# EAGLE design cc2652p_ch340e (EAGLE 9.6.2)
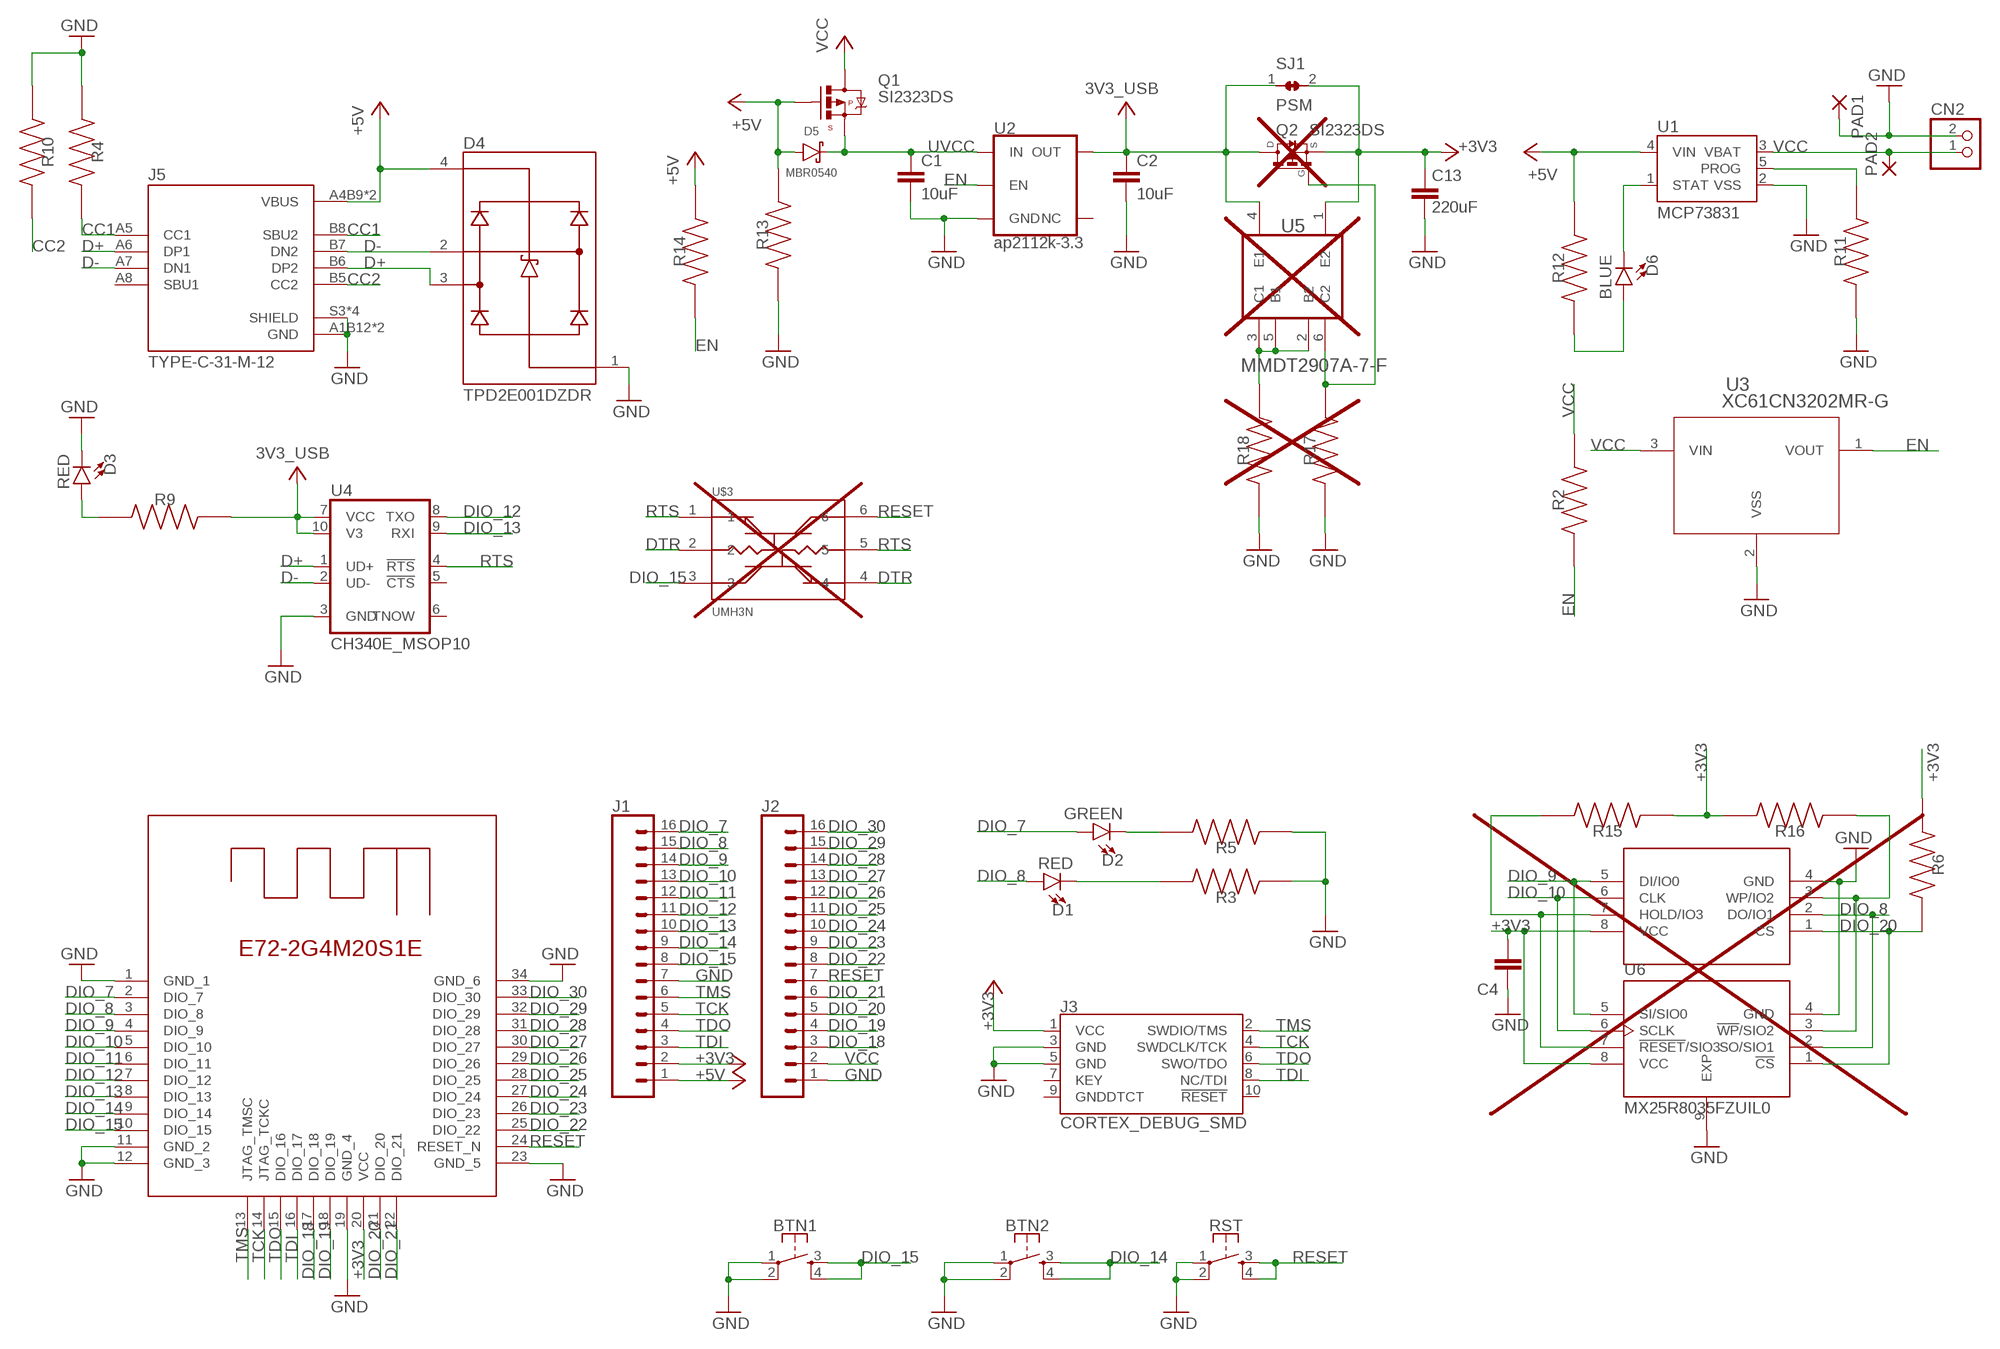
[diagram p0: schematic, sheet 1]

## Parts
BTN1  MOMENTARY-SWITCH-SPST-2-SMD-4.6X2.8MM  [TACTILE_SWITCH_SMD_4.6X2.8MM]
BTN2  MOMENTARY-SWITCH-SPST-2-SMD-4.6X2.8MM  [TACTILE_SWITCH_SMD_4.6X2.8MM]
C1  10uF  10UF-0603-6.3V-20%  [0603]
C2  10uF  10UF-0603-6.3V-20%  [0603]
C4  100n  CAP0402  [CAPC1005X40N]
C13  220uF  C_TANTALUM-2917(7343-METRIC)  [CAPM7343X310]
CN2  JST_2PIN-SMT-RA  [JST-PH-2-SMT-RA]
D1  RED  LED-RED0603  [LED-0603]
D2  GREEN  LED-GREEN0603  [LED-0603]
D3  RED  LED-RED0603  [LED-0603]
D4  TPD2E001DZDR  [SOT192P237X122-4N]
D5  MBR0540  DIODE-SCHOTTKY  [SOD-323]
D6  BLUE  LED-BLUE0603  [LED-0603]
J1  CONN_161X16_NO_SILK  [1X16_NO_SILK]
J2  CONN_161X16_NO_SILK  [1X16_NO_SILK]
J3  CORTEX_DEBUG_SMD  [SAMTECH_FTSH-105-01]
J5  TYPE-C-31-M-12  [HRO_TYPE-C-31-M-12]
PAD1  WIREPADSMD1,27-254  [SMD1,27-2,54]
PAD2  WIREPADSMD1,27-254  [SMD1,27-2,54]
Q1  SI2323DS  MOSFET-PCHANNEL  [SOT23]
Q2  SI2323DS  [SOT23]
R2  10k  RC0402FR-073M6L  [RESC1005X40N]
R3  2.2k  RC0402FR-073M6L  [RESC1005X40N]
R4  5.1k  RC0402FR-073M6L  [RESC1005X40N]
R5  2.2k  RC0402FR-073M6L  [RESC1005X40N]
R6  2.2k  RC0402FR-073M6L  [RESC1005X40N]
R9  2.2k  RC0402FR-073M6L  [RESC1005X40N]
R10  5.1k  RC0402FR-073M6L  [RESC1005X40N]
R11  2k  RC0402FR-073M6L  [RESC1005X40N]
R12  2.2k  RC0402FR-073M6L  [RESC1005X40N]
R13  10k  RC0402FR-073M6L  [RESC1005X40N]
R14  10k  RC0402FR-073M6L  [RESC1005X40N]
R15  0  RC0402FR-073M6L  [RESC1005X40N]
R16  0  RC0402FR-073M6L  [RESC1005X40N]
R17  100k  RC0402FR-073M6L  [RESC1005X40N]
R18  100k  RC0402FR-073M6L  [RESC1005X40N]
RST  MOMENTARY-SWITCH-SPST-2-SMD-4.6X2.8MM  [TACTILE_SWITCH_SMD_4.6X2.8MM]
SJ1  PSM  SMALL_SOLDER_JUMPER_CLOSED  [SMALL_SOLDER_JUMPER_CLOSED]
U1  MCP73831  [SOT23-5]
U2  ap2112k-3.3  V_REG_AP2112K-3.3V  [SOT23-5]
U3  XC61CN3202MR-G  [XC61C_SOT-23_TOR]
U4  CH340E_MSOP10  [MSOP10]
U5  MMDT2907A-7-F  [SOT65P210X110-6N]
U6  MX25R8035FZUIL0  [PSON50P200X300X60-9N]
U$1  E72-2G4M20S1E  [E72-2G4M20S1E]
U$2  MX25R8035FM1IL0  W25Q80BVSNIG  [SO-8]
U$3  UMH3N  [SOP65P210X100-6N]

## Nets
+3V3: C4.2 C13.1 J1.2 J3.1(VCC) Q2.2(S) R6.1 R15.1 R16.2 SJ1.2 U5.1(E2) U6.8(VCC) U$1.20(VCC) U$2.8(VCC)
+5V: D4.4(VCC) D5.A J1.1 J5.A4B9(VBUS) J5.B4A9(VBUS) Q1.1(G) R12.2 R13.2 R14.2 U1.4(VIN)
CC1: J5.A5(CC1) J5.B8(SBU2) R4.2
CC2: J5.B5(CC2) R10.2
D+: D4.3(IO2) J5.A6(DP1) J5.B6(DP2) U4.1(UD+)
D-: D4.2(IO1) J5.A7(DN1) J5.B7(DN2) U4.2(UD-)
DIO_7: D2.A J1.16 U$1.2(DIO_7)
DIO_8: D1.A J1.15 U6.2(SO/SIO1) U$1.3(DIO_8) U$2.2(DO/IO1)
DIO_9: J1.14 U6.5(SI/SIO0) U$1.4(DIO_9) U$2.5(DI/IO0)
DIO_10: J1.13 U6.6(SCLK) U$1.5(DIO_10) U$2.6(CLK)
DIO_11: J1.12 U$1.6(DIO_11)
DIO_12: J1.11 U4.8(TXO) U$1.7(DIO_12)
DIO_13: J1.10 U4.9(RXI) U$1.8(DIO_13)
DIO_14: BTN2.3 BTN2.4 J1.9 U$1.9(DIO_14)
DIO_15: BTN1.3 BTN1.4 J1.8 U$1.10(DIO_15) U$3.3
DIO_18: J2.3 U$1.17(DIO_18)
DIO_19: J2.4 U$1.18(DIO_19)
DIO_20: J2.5 R6.2 U6.1(!CS) U$1.21(DIO_20) U$2.1(CS)
DIO_21: J2.6 U$1.22(DIO_21)
DIO_22: J2.8 U$1.25(DIO_22)
DIO_23: J2.9 U$1.26(DIO_23)
DIO_24: J2.10 U$1.27(DIO_24)
DIO_25: J2.11 U$1.28(DIO_25)
DIO_26: J2.12 U$1.29(DIO_26)
DIO_27: J2.13 U$1.30(DIO_27)
DIO_28: J2.14 U$1.31(DIO_28)
DIO_29: J2.15 U$1.32(DIO_29)
DIO_30: J2.16 U$1.33(DIO_30)
DTR: U$3.2 U$3.4
EN: R2.1 R14.1 U2.3(EN) U3.1(VOUT)
GND: BTN1.1 BTN1.2 BTN2.1 BTN2.2 C1.2 C2.2 C4.1 C13.2 CN2.2 D3.C D4.1(GND) J1.7 J2.1 J3.3(GND) J3.5(GND) J5.A1B12(GND) J5.B1A12(GND) J5.S3(SHIELD) J5.S4(SHIELD) J5.S5(SHIELD) J5.S6(SHIELD) PAD1.1(P) R3.1 R4.1 R5.1 R10.1 R11.1 R13.1 R17.1 R18.1 RST.1 RST.2 U1.2(VSS) U2.2(GND) U3.2(VSS) U4.3(GND) U6.4(GND) U6.9(EXP) U$1.1(GND_1) U$1.11(GND_2) U$1.12(GND_3) U$1.19(GND_4) U$1.23(GND_5) U$1.34(GND_6) U$2.4(GND)
N$2: D1.C R3.2
N$3: D2.C R5.2
N$4: R18.2 U5.2(B2) U5.3(C1) U5.5(B1)
N$7: D3.A R9.2
N$8: R11.2 U1.5(PROG)
N$9: D6.A R12.1
N$10: Q2.1(G) R17.2 U5.6(C2)
N$11: D6.C U1.1(STAT)
N$12: R15.2 U6.7(!RESET!/SIO3) U$2.7(HOLD/IO3)
N$15: R16.1 U6.3(!WP!/SIO2) U$2.3(WP/IO2)
RESET: J2.7 RST.3 RST.4 U$1.24(RESET_N) U$3.6
RTS: U4.4(!RTS) U$3.1 U$3.5
TCK: J1.5 J3.4(SWDCLK/TCK) U$1.14(JTAG_TCKC)
TDI: J1.3 J3.8(NC/TDI) U$1.16(DIO_17)
TDO: J1.4 J3.6(SWO/TDO) U$1.15(DIO_16)
TMS: J1.6 J3.2(SWDIO/TMS) U$1.13(JTAG_TMSC)
UVCC: C1.1 D5.C Q1.2(S) U2.1(IN)
V+: C2.1 Q2.3(D) R9.1 SJ1.1 U2.5(OUT) U4.7(VCC) U4.10(V3) U5.4(E1) ; supply symbol labelled 3V3_USB
VCC: CN2.1 J2.2 PAD2.1(P) Q1.3(D) R2.2 U1.3(VBAT) U3.3(VIN)
Unconnected: J3.7(KEY) J3.9(GNDDTCT) J3.10(!RESET) J5.A8(SBU1) U2.4(NC) U4.5(!CTS) U4.6(TNOW)

## Library data of the parts
BTN1 BTN2 RST = SparkFun-Switches:MOMENTARY-SWITCH-SPST-2: Momentary Switch (Pushbutton) - SPST - Two Circuits Normally-open (NO) SPST momentary switches (buttons, pushbuttons). Schematic symbol includes two switch circuits. Variants SMD-4.6MMX2.8MM - 4.60mm x 2.80mm Tactile Momentary Button Switch - Used on SparkFun SAMD21 Mini Breakout <https://www.sparkfun.com/products/13664> SMD-5.2MM - Mini Pushbutton Switch - SMD <https://www.sparkfun.com/products/8720> - Used on Arduino Pro Mini <https://www.sparkfun.com/products/11114>; PROD_ID: SWCH-13065
C1 C2 = SparkFun-Capacitors:10UF: 10.0µF ceramic capacitors A capacitor is a passive two-terminal electrical component used to store electrical energy temporarily in an electric field.; PROD_ID: CAP-11015
C4 = discretes-dev:CAP0402: CAP, 0402; AVAILABILITY: Good; DESCRIPTION: RESISTOR, 0402 0.063W 1% 3M6; Resistance:3.6Mohm; Resistance Tolerance:± 1%; Power Rating:0.063W; Voltage Rating:50V; Series:RC32H; Temperature Coefficient:± 100ppm/°C; Resistor Element Type:Thick Film; Resistor Case Style:0402; No. of Pins:2; SVHC:No SVHC; Case Style:0402; External Length / Height:1mm; Temperature Coeff. +:100ppm/°C; Temperature Coeff. -:100ppm/°C; External Depth:0.35mm; External Width:0.5mm; Operating Temperature Range:-55°C to +155°C; Overload Voltage:100V; MF: Yageo; MP: RC0402FR-073M6L; PACKAGE: 1005 Panasonic Electronic Components; PRICE: None; PURCHASE-URL: https://pricing.snapeda.com/search/part/RC0402FR-073M6L/?ref=eda
C13 = Capacitor:C: Capacitor - Generic; CATEGORY: Capacitor
CN2 = adafruit:JST_2PIN: JST 2-Pin Connectors of various flavors SMT-RA (S2B-PH-SM4) 4UConnector #17311 SMT (B2B-PH-SM4) THM-RA (S2B-PH) THM (B2B-PH)
D1 D3 = SparkFun-LED:LED-RED: Red SMD LED Used in manufacturing of most products at SparkFun Packages: 0603 - SMD 0603 package [Product Link] <http://docs.avagotech.com/docs/AV02-0551EN> 0603 SMART - SMD 0603 SMART package ( more efficient and expensive)[Product Link] <http://www.osram-os.com/Graphics/XPic2/00077099_0.pdf> 1206 - SMD1206 package [Product Link] <https://www.sparkfun.com/datasheets/DevTools/LilyPad/Q150OVS4.pdff> SparkFun Products: Pro Mini 328 -5V <https://www.sparkfun.com/products/821> RedBoard <https://www.sparkfun.com/products/12757> IOIO-OTG <https://www.sparkfun.com/products/13613>; PROD_ID: DIO-00819
D2 = SparkFun-LED:LED-GREEN: Green SMD LED Used in manufacturing of various products at SparkFun Packages: 0603 - SMD 0603 package [Product Link] <http://www.futureelectronics.com/en/technologies/semiconductors/optoelectronics/leds/Pages/9894312-LTST-C190GKT.aspx?CrossPart=HSMG-C190&IM=0> LilyPad 1206 - SMD1206 LilyPad package [Product Link] <http://www.futureelectronics.com/en/Technologies/Product.aspx?ProductID=IN150NGHARVATEKCORPORATION2049943&IM=0> 1206 - SMD1206 package [Product Link] <http://www.futureelectronics.com/en/technologies/semiconductors/optoelectronics/leds/Pages/8315665-LTST-C150KGKT.aspx?IM=0> 1206 Bottom Mount -SMD 1206 Bottom Mount [Product Link] <http://www.digikey.com/product-detail/en/lite-on-inc/LTST-C230KGKT/160-1456-1-ND/386854> SparkFun Products: Pro Mini 328 -5V <https://www.sparkfun.com/products/821> RedBoard <https://www.sparkfun.com/products/12757> MP3 Trigger <https://www.sparkfun.com/products/13720> Makey Makey <https://www.sparkfun.com/products/11076>; PROD_ID: DIO-00821
D4 = TPD2E001DZDR:TPD2E001DZDR: Low-capacitance 2-channel +/-15k-V ESD protection array for high-speed data interfaces Check prices <https://pricing.snapeda.com/parts/TPD2E001DZDR/Texas%20Instruments/view-part?ref=eda>; AVAILABILITY: In Stock; DESCRIPTION: Low-capacitance 2-channel +/-15k-V ESD protection array for high-speed data interfaces 4-SOT-23 -40 to 85; MF: Texas Instruments; MP: TPD2E001DZDR; PACKAGE: SOT-23-4 Texas Instruments; PRICE: None; PURCHASE-URL: https://pricing.snapeda.com/search/part/TPD2E001DZDR/?ref=eda
D5 = pimoroni-passives:DIODE-SCHOTTKY
D6 = SparkFun-LED:LED-BLUE: Blue SMD LED Used in manufacturing of various products at SparkFun Packages: 0603 - SMD 0603 package [Product Link] <http://www.digikey.com/product-detail/en/SMLE12BC7TT86/511-1589-2-ND/1641808> 1206 - SMD1206 package [Product Link] <http://www.digikey.com/product-detail/en/lite-on-inc/LTST-C150TBKT/160-1643-1-ND/573584> SparkFun Products: ESP8266 Thing-Dev Board <https://www.sparkfun.com/products/13711> RedBoard <https://www.sparkfun.com/products/12757>; PROD_ID: DIO-08575
J1 J2 = SparkFun-Connectors:CONN_16: Multi connection point. Often used as Generic Header-pin footprint for 0.1 inch spaced/style header connections On any of the 0.1 inch spaced packages, you can populate with these: Break Away Headers - Straight <https://www.sparkfun.com/products/116> (PRT-00116) Break Away Male Headers - Right Angle <https://www.sparkfun.com/products/553> (PRT-00553) Female Headers <https://www.sparkfun.com/products/115> (PRT-00115) Break Away Headers - Machine Pin <https://www.sparkfun.com/products/117> (PRT-00117) Break Away Female Headers - Swiss Machine Pin <https://www.sparkfun.com/products/743> (PRT-00743) For SCREWTERMINALS and SPRING TERMINALS visit here: Screw Terimnals on SparkFun.com <https://www.sparkfun.com/search/results?term=Screw+Terminals> (5mm/3.5mm/2.54mm spacing) This device is also useful as a general connection point to wire up your design to another part of your project. Our various solder wires solder well into these plated through hole pads. Hook-Up Wire - Assortment (Stranded, 22 AWG) <https://www.sparkfun.com/products/11375> (PRT-11375) Hook-Up Wire - Assortment (Solid Core, 22 AWG) <https://www.sparkfun.com/products/11367> (PRT-11367) View the entire wire category on our website here <https://www.sparkfun.com/categories/141> Special notes: Molex polarized connector foot print use with SKU : PRT-08231 with associated crimp pins and housings. 1MM SMD Version SKU: PRT-10208 NOTES ON THE VARIANTS LOCK and LOCK_LONGPADS... This footprint was designed to help hold the alignment of a through-hole component (i.e. 6-pin header) while soldering it into place. You may notice that each hole has been shifted either up or down by 0.005 of an inch from it's more standard position (which is a perfectly straight line). This slight alteration caused the pins (the squares in the middle) to touch the edges of the holes. Because they are alternating, it causes a "brace" to hold the component in place. 0.005 has proven to be the perfect amount of "off-center" position when using our standard breakaway headers. Although looks a little odd when you look at the bare footprint, once you have a header in there, the alteration is very hard to notice. Also,if you push a header all the way into place, it is covered up entirely on the bottom side.
J3 = SparkFun-Connectors:CORTEX_DEBUG: Cortex Debug Connector - 10 pin Supports JTAG debug, Serial Wire debug, and Serial Wire Viewer. PTH and SMD connector options available. General Connector Information <http://infocenter.arm.com/help/topic/com.arm.doc.faqs/attached/13634/cortex_debug_connectors.pdf> Products: PTH Connector <http://www.digikey.com/product-detail/en/cnc-tech/3220-10-0100-00/1175-1627-ND/3883661> -via Digi-Key SparkFun PSoc <https://www.sparkfun.com/products/13229> SparkFun T <https://www.sparkfun.com/products/13810>
J5 = TYPE-C-31-M-12:TYPE-C-31-M-12: USB Connectors 24 Receptacle 1 8.94*7.3mm RoHS Check availability <https://pricing.snapeda.com/parts/TYPE-C-31-M-12/HRO%20Electronics%20Co.%2C%20Ltd./view-part?ref=eda>; AVAILABILITY: Not in stock; DESCRIPTION: USB Connectors 24 Receptacle 1 8.94*7.3mm RoHS; MF: HRO Electronics Co., Ltd.; MP: TYPE-C-31-M-12; PACKAGE: Package; PRICE: None
PAD1 PAD2 = wirepad:WIREPAD: Wire PAD connect wire on PCB
Q1 = pimoroni-passives:MOSFET-PCHANNEL: Generic PMOSFET
Q2 = SI2323DS:SI2323DS: P-Channel MOSFET; AVAILABILITY: Unavailable; DESCRIPTION: P-Channel 20V 3.7A (Ta) 750mW (Ta) Surface Mount SOT-23-3 (TO-236); MF: Vishay Siliconix; MP: SI2323DS; PACKAGE: SOT-23-3 Vishay Siliconix; PRICE: None
R2-R6 R9-R18 = RC0402FR-073M6L:RC0402FR-073M6L: RESISTOR, 0402 0.063W 1% 3M6; Resistance:3.6Mohm; Resistance Tolerance:± 1%; Power Rating:0.063W; Voltage Rating:50V; Series:RC32H; Temperature Coefficient:± 100ppm/°C; Resistor Element Type:Thick Film; Resistor Case Style:0402; No. of Pins:2; SVHC:No SVHC; Case Style:0402; External Length / Height:1mm; Temperature Coeff. +:100ppm/°C; Temperature Coeff. -:100ppm/°C; External Depth:0.35mm; External Width:0.5mm; Operating Temperature Range:-55°C to +155°C; Overload Voltage:100V Check prices <https://pricing.snapeda.com/parts/RC0402FR-073M6L/Yageo/view-part?ref=eda>; AVAILABILITY: Good; DESCRIPTION: RESISTOR, 0402 0.063W 1% 3M6; Resistance:3.6Mohm; Resistance Tolerance:± 1%; Power Rating:0.063W; Voltage Rating:50V; Series:RC32H; Temperature Coefficient:± 100ppm/°C; Resistor Element Type:Thick Film; Resistor Case Style:0402; No. of Pins:2; SVHC:No SVHC; Case Style:0402; External Length / Height:1mm; Temperature Coeff. +:100ppm/°C; Temperature Coeff. -:100ppm/°C; External Depth:0.35mm; External Width:0.5mm; Operating Temperature Range:-55°C to +155°C; Overload Voltage:100V; MF: Yageo; MP: RC0402FR-073M6L; PACKAGE: 1005 Panasonic Electronic Components; PRICE: None; PURCHASE-URL: https://pricing.snapeda.com/search/part/RC0402FR-073M6L/?ref=eda
SJ1 = pimoroni-misc:SMALL_SOLDER_JUMPER_CLOSED
U1 = SparkFun-IC-Power:MCP73831: MCP73831T Li-Ion, Li-Pol Controller Miniature single cell, fully integrated Li-Ion, Li-polymer charge management controller Datasheet <http://ww1.microchip.com/downloads/en/DeviceDoc/20001984g.pdf> SparkFun Products: SparkFun ESP32 Thing <https://www.sparkfun.com/products/13907> SparkFun 9DoF Razor IMU M0 <https://www.sparkfun.com/products/14001>; PROD_ID: IC-09995
U2 = SparkFun-IC-Power:V_REG_AP2112: AP2112 - 600mA CMOS LDO Regulator w/ Enable The AP2112 is CMOS process low dropout linear regulator with enable function, the regulator delivers a guaranteed 600mA (min.) continuous load current. Features Output Voltage Accuracy: ±1.5% Output Current: 600mA (Min.) Foldback Short Current Protection: 50mA Enable Function to Turn ON/OFF VOUT Low Dropout Voltage (3.3V): 250mV (Typ.) @IOUT=600mA Excellent Load Regulation: 0.2%/A (Typ.) Excellent Line Regulation: 0.02%/V (Typ.) Low Quiescent Current: 55μA (Typ.) Low Standby Current: 0.01μA (Typ.) Low Output Noise: 50μVRMS PSRR: 100Hz -65dB, 1kHz -65dB OTSD Protection Stable with 1.0μF Flexible Cap: Ceramic, Tantalum and Aluminum Electrolytic Operation Temperature Range: -40°C to 85°C ESD: MM 400V, HBM 4000V; PROD_ID: VREG-12457; VALUE: 3.3V
U3 = XC61CN3202MRG:XC61CN3202MR-G; BUILT_BY: EMA_UL_Team; MANUFACTURER_PART_NUMBER: XC61CN3202MR-G; SOURCELIBRARY: Torex_2016-06-30_2; VENDOR: Torex Semiconductor
U4 = CH340E:CH340E: Check prices <https://pricing.snapeda.com/parts/CH340E/WCH/view-part?ref=eda>; AVAILABILITY: Not in stock; DESCRIPTION: USB to serial chip CH340; MF: WCH; MP: CH340E; PACKAGE: Package; PRICE: None
U5 = MMDT2907A-7-F:MMDT2907A-7-F: DUAL PNP SMALL SIGNAL SURFACE MOUNT TRANSISTOR Check availability <https://pricing.snapeda.com/parts/MMDT2907A-7-F/Diodes%20Inc./view-part?ref=eda>; AVAILABILITY: In Stock; DESCRIPTION: Bipolar (BJT) Transistor Array 2 PNP (Dual) 60V 600mA 200MHz 200mW Surface Mount SOT-363; MF: Diodes Inc.; MP: MMDT2907A-7-F; PACKAGE: SOT-363 Diodes Inc.; PRICE: None; PURCHASE-URL: https://pricing.snapeda.com/search/part/MMDT2907A-7-F/?ref=eda
U6 = MX25R8035FZUIL0:MX25R8035FZUIL0: FLASH - NOR Memory IC 8Mb (1M x 8) SPI - Quad I/O 33 MHz 8-USON (2x3) Check availability <https://pricing.snapeda.com/parts/MX25R8035FZUIL0/Macronix/view-part?ref=eda>; AVAILABILITY: In Stock; DESCRIPTION: NOR Flash Serial 1.8V/3.3V 8M-bit 8M/4M/2M x 1/2-bit/4-bit 12ns 8-Pin USON EP; MF: Macronix; MP: MX25R8035FZUIL0; PACKAGE: None; PRICE: None; PURCHASE-URL: https://pricing.snapeda.com/search/part/MX25R8035FZUIL0/?ref=eda
U$1 = E72-2G4M20S1E:E72-2G4M20S1E
U$2 = W25Q80BVSNIG:W25Q80BVSNIG: Check availability <https://pricing.snapeda.com/parts/W25Q80BVSNIG/Winbond%20Electronics/view-part?ref=eda>; AVAILABILITY: In Stock; DESCRIPTION: FLASH - NOR Memory IC 8Mb (1M x 8) SPI - Quad I/O 104 MHz 8-SOIC; MF: Winbond Electronics; MP: W25Q80BVSNIG; PACKAGE: SOIC-8 Winbond; PRICE: None
U$3 = UMH3N:UMH3N: Dual PNP/NPN transistor for chip reset; AVAILABILITY: Unavailable; DESCRIPTION: Pre-Biased Bipolar Transistor (BJT) 2 NPN - Pre-Biased (Dual) 50V 100mA 250MHz 150mW Surface Mount UMT6; MF: Rohm; MP: UMH3N; PACKAGE: SOT-363 Rohm; PRICE: None

## Board
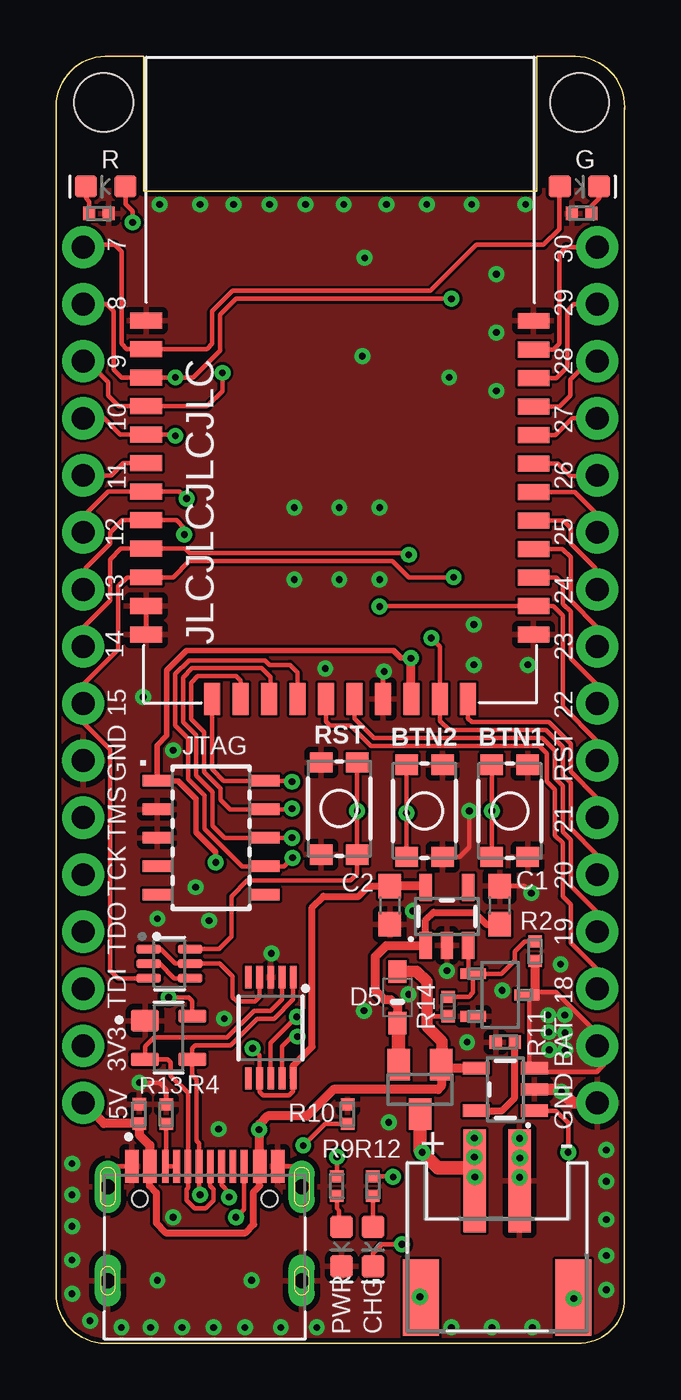
[diagram p1: board, top side]
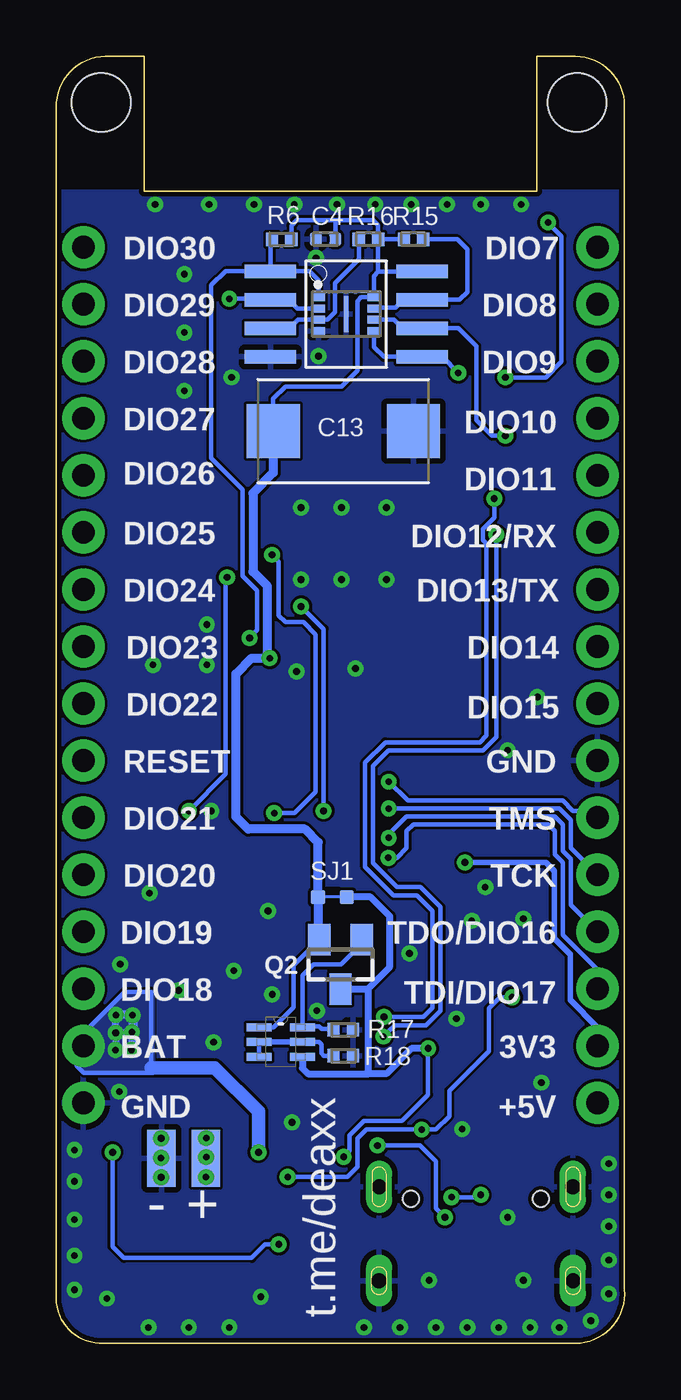
[diagram p2: board, bottom side, seen from below]

Size 25.32 x 57.31 mm. Coordinates in mm from the lower left corner, seen from the top.
Outline: 2.31,0.01 2.41,0.01
Outline: 2.41,0.01 23.21,0.01 arc87 25.31,1.81 25.31,54.81
Outline: 2.31,57.31 2.41,57.31
Outline: 2.41,57.31 arc87 0.01,55.31 0.01,2.41 arc100 2.41,0.01
Outline: 2.41,57.31 3.91,57.31 3.91,51.31 21.41,51.31 21.41,57.31 22.91,57.31
Outline: 22.91,57.31 23.01,57.31
Outline: 25.31,55.01 25.31,54.81
Outline: 22.91,57.31 arc-100 25.31,54.81
Copper layers (1*16): Top 0.035mm / dielectric 1.5mm / Bottom 0.035mm
Design rules "default *": minimum track width 0.2mm, minimum drill 0.3mm, track to track 5mil, track to pad 5mil, pad to pad 5mil, via to via 5mil, smd to smd 5mil, copper to edge 0.2mm, drill to drill 0.3mm, minimum pad ring 10mil, minimum via ring 8mil, stop-mask expansion 2mil, vias tented up to drill 0.3mm, thermal gap 10mil
Holes 2.6 mm at 2.12,55.26 23.32,55.26
bRestrict: 4 lines

### Footprints (pad centres in the part's own frame; a part is rotated, then mirrored left to right if it is on the bottom)
TACTILE_SWITCH_SMD_4.6X2.8MM = smd 0.9 x 1: 1 -2.05,-0.8; 2 2.05,-0.8; 3 2.05,0.8; 4 -2.05,0.8
0603 = smd 1.1 x 1: 1 -0.85,0; 2 0.85,0
CAPC1005X40N = smd 0.54 x 0.6: 1 -0.432,0; 2 0.432,0
CAPM7343X310 = smd 2.368 x 2.404: 1 -3.121,0; 2 3.121,0
JST-PH-2-SMT-RA = smd 1 x 4.6: 1 1,-3.7; 2 -1,-3.7 | smd 1.6 x 3.4: NC1 -3.4,1.5; NC2 3.4,1.5
LED-0603 = smd 1 x 1: A -0.877,0; C 0.877,0
SOT192P237X122-4N = smd 1.24 x 0.99: 1 -1.055,0.76 | smd 1.24 x 0.59: 2 -1.055,-0.96; 3 1.055,-0.96; 4 1.055,0.96
SOD-323 = smd 1 x 0.8: A 1.15,0; C -1.15,0
1X16_NO_SILK = drill 1.016 pad 1.88: 1 0,0; 2 2.54,0; 3 5.08,0; 4 7.62,0; 5 10.16,0; 6 12.7,0; 7 15.24,0; 8 17.78,0; 9 20.32,0; 10 22.86,0; 11 25.4,0; 12 27.94,0; 13 30.48,0; 14 33.02,0; 15 35.56,0; 16 38.1,0
SAMTECH_FTSH-105-01 = smd 0.508 x 1.27: 1 -2.54,-2.413; 2 -2.54,2.413; 3 -1.27,-2.413; 4 -1.27,2.413; 5 0,-2.413; 6 0,2.413; 7 1.27,-2.413; 8 1.27,2.413; 9 2.54,-2.413; 10 2.54,2.413
HRO_TYPE-C-31-M-12 = smd 0.6 x 1.45: A1B12 -3.25,5.095; A4B9 -2.45,5.095; B1A12 3.25,5.095; B4A9 2.45,5.095 | smd 0.3 x 1.45: A5 -1.25,5.095; A6 -0.25,5.095; A7 0.25,5.095; A8 1.25,5.095; B5 1.75,5.095; B6 0.75,5.095; B7 -0.75,5.095; B8 -1.75,5.095 | drill 0.65 pad 1.05 long: S1 -4.313,4.182; S2 4.318,4.187; S3 -4.32,0; S4 4.32,0; S5 -4.315,4.191; S6 4.318,4.18 | hole 0.7: -2.89,3.65; 2.89,3.65
SMD1,27-2,54 = smd 1.27 x 2.54: 1 0,0
SOT23 = smd 1 x 1.4: 1 -0.95,-1.1; 2 0.95,-1.1; 3 0,1.1
RESC1005X40N = smd 0.54 x 0.6: 1 -0.432,0; 2 0.432,0
SMALL_SOLDER_JUMPER_CLOSED = smd 0.635 x 0.635: 1 -0.635,0; 2 0.635,0
SOT23-5 = smd 0.55 x 1.2: 1 -0.95,-1.3; 2 0,-1.3; 3 0.95,-1.3; 4 0.95,1.3; 5 -0.95,1.3
XC61C_SOT-23_TOR = smd 0.483 x 1.118: 1 -0.95,-1.194; 2 0.95,-1.194; 3 0,1.194
MSOP10 = smd 1 x 0.3: 1 -2.25,1; 2 -2.25,0.5; 3 -2.25,0; 4 -2.25,-0.5; 5 -2.25,-1; 6 2.25,-1; 7 2.25,-0.5; 8 2.25,0; 9 2.25,0.5; 10 2.25,1
SOT65P210X110-6N = smd 1.118 x 0.356: 1 -0.965,0.66; 2 -0.965,0; 3 -0.965,-0.66; 4 0.965,-0.66; 5 0.965,0; 6 0.965,0.66
PSON50P200X300X60-9N = smd 0.56 x 0.35: 1 -1.235,0.75; 2 -1.235,0.25; 3 -1.235,-0.25; 4 -1.235,-0.75; 5 1.235,-0.75; 6 1.235,-0.25; 7 1.235,0.25; 8 1.235,0.75 | smd 0.2 x 1.6: 9 0,0
E72-2G4M20S1E = smd 0.711 x 1.422: 1 17.098,17.411; 2 15.828,17.411; 3 14.558,17.411; 4 13.288,17.411; 5 12.018,17.411; 6 10.748,17.411; 7 9.478,17.411; 8 8.208,17.411; 9 6.938,17.411; 10 5.668,17.411; 11 4.398,17.411; 12 3.128,17.411; 23 3.115,0.143; 24 4.385,0.143; 25 5.655,0.143; 26 6.925,0.143; 27 8.195,0.143; 28 9.465,0.143; 29 10.735,0.143; 30 12.005,0.143; 31 13.275,0.143; 32 14.545,0.143; 33 15.815,0.143; 34 17.085,0.143 | smd 1.422 x 0.711: 13 0.246,14.471; 14 0.246,13.201; 15 0.246,11.931; 16 0.246,10.661; 17 0.246,9.391; 18 0.246,8.121; 19 0.246,6.851; 20 0.246,5.581; 21 0.246,4.311; 22 0.244,3.064
SO-8 = smd 2.286 x 0.61: 1 -3.378,1.27; 2 -3.378,0; 3 -3.378,-1.27; 4 -3.378,-2.54; 5 3.378,-2.54; 6 3.378,-1.27; 7 3.378,0; 8 3.378,1.27
SOP65P210X100-6N = smd 1.09 x 0.4: 1 -0.92,0.65; 2 -0.92,0; 3 -0.92,-0.65; 4 0.92,-0.65; 5 0.92,0; 6 0.92,0.65

### Placement (x,y rotation side)
BTN1  20.21,23.71 90 top
BTN2  16.41,23.71 90 top
C1  19.76,19.51 90 top
C2  14.86,19.51 270 top
C4  13.32,49.16 0 bottom
C13  12.53,40.62 0 bottom
CN2  19.64,3.54 180 top
D1  2.21,51.51 180 top
D2  23.31,51.51 0 top
D3  12.71,4.31 270 top
D4  5.01,13.61 0 top
D5  15.21,15.41 90 top
D6  14.11,4.31 270 top
J1  1.21,10.71 90 top
J2  24.11,10.71 90 top
J3  6.91,22.51 270 top
J5  6.62,2.79 0 top
PAD1  20.63,8.25 0 bottom
PAD2  18.66,8.25 0 bottom
Q1  16.21,11.31 180 top
Q2  12.66,16.87 180 bottom
R2  21.33,17.46 270 top
R3  1.91,50.31 180 top
R4  4.91,10.21 270 top
R5  23.41,50.31 0 top
R6  15.28,49.16 180 bottom
R9  12.51,7.01 270 top
R10  12.98,10.21 270 top
R11  20.01,13.41 0 top
R12  14.11,7.01 90 top
R13  3.7,10.22 270 top
R14  17.46,15 270 top
R15  9.4,49.16 0 bottom
R16  11.41,49.16 0 bottom
R17  12.53,13.97 180 bottom
R18  12.53,12.81 180 bottom
RST  12.61,23.81 270 top
SJ1  13.02,19.87 180 bottom
U1  20.01,11.31 90 top
U2  17.41,19.01 0 top
U3  19.77,15.51 270 top
U4  9.56,14.05 270 top
U5  15.31,13.42 0 bottom
U6  12.4,45.83 0 bottom
U$1  21.41,28.44 90 top
U$2  12.4,46.46 0 bottom
U$3  5.05,16.91 0 top

### Tracks (layer width: path | path; a pad name or v marks a point on that pad's centre or on a via)
+3V3  (via drill 0.3)
  Top 0.2: 4.54,25.01 J3.1 | 15.76,30.56 v15.81,30.51
  Top 0.254: v7.11,21.41 7.11,21.87 6.24,22.74 6.24,24.25 5.44,25.05 J3.1 4.5,26.63 4.93,27.06 4.93,29.96 5.81,30.84 15.02,30.84 15.35,30.51 v15.81,30.51
  Top 0.406: U$1.20 15.81,28.71 v15.81,30.51
  Bottom 0.2: U5.1 15.64,14.08 14.75,14.97 14.75,16.83 Q2.2 | U6.8 11.11,46.64 | U6.8 11.74,46.58 11.91,46.41 11.91,43.31 12.61,42.61 15.11,42.61 15.65,42.07 C13.1 | R15.1 R16.2 | R16.2 10.98,49.78 11.21,50.01 12.91,50.01 | 12.91,50.01 14.61,50.01 14.85,49.77 R6.1 | C4.2 12.89,49.99 12.91,50.01 | 11.21,46.62 U6.8 | U$2.8 9.05,47.71 10.96,47.71 | 10.96,47.71 10.98,47.71 11.17,47.52 U6.8 | R16.2 10.98,47.72 10.96,47.71
  Bottom 0.254: v7.11,21.41 3.5,21.41 3.13,21.04 3.13,18.03 2.43,17.33 2.43,15.28 1.21,14.07 J1.2 | 13.74,18.11 Q2.2
  Bottom 0.406: 13.74,18.11 13.65,18.2 SJ1.2 13.65,22.31 14.24,22.89 16.77,22.89 17.31,23.44 17.31,29.81 16.61,30.51 v15.81,30.51 15.91,30.61 15.91,33.71 16.56,34.36 16.56,37.86 15.65,38.77 C13.1
+5V  (via drill 0.3)
  Top 0.2: D4.4 6.06,15.25 5.91,15.41 v5.01,15.41 4.91,15.41 | R12.2 14.98,7.44 v15.01,7.41 | R13.2 3.71,9.78 | R14.2 16.56,14.57 16.51,14.62
  Top 0.254: v9.04,9.52 9.06,9.54
  Top 0.305: 15.36,16.71 D5.A | 9.06,9.76 9.04,9.74 | J5.B4A9 9.07,7.02 8.8,6.75 8.8,5.3 8.41,4.91 4.91,4.91 4.46,5.36 4.46,6.71 4.16,7.01 J5.A4B9
  Top 0.406: U1.4 17.31,12.26 Q1.1 17.16,11.46 17.01,11.31 12.35,11.31 11.17,10.13 9.43,10.13 9.06,9.76 | 15.26,16.61 D5.A | 9.04,9.74 v9.04,9.52 9.06,9.52 9.07,9.51 J5.B4A9 | 3.71,9.78 3.71,9.29 4.17,8.83 J5.A4B9 | R13.2 2.13,9.79 J1.1
  Top 0.508: D5.A 16.06,16.56 16.51,16.11 16.51,14.62 16.51,14.11 17.18,13.44 17.18,12.43 Q1.1
  Bottom 0.2: v5.01,15.41 5.55,15.41 6.05,14.91 6.05,13.01 7.81,11.25 7.81,10.11 8.4,9.52 v9.04,9.52 11.5,9.52 11.89,9.13 11.89,7.86 12.34,7.41 v15.01,7.41
CC1
  Top 0.2: R4.2 4.91,9.11 4.91,7.91 J5.B8 | J5.B8 | J5.B8 J5.A5
CC2  (via drill 0.3)
  Top 0.2: R10.2 11.98,9.78 v11.01,8.81 | J5.B5 8.37,5.97 v8.01,5.61
  Bottom 0.2: v8.01,5.61 8.41,6.01 8.41,8.11 9.11,8.81 v11.01,8.81
D+  (via drill 0.3)
  Top 0.2: 6.36,6.66 v6.41,6.61 6.37,6.65 J5.A6 6.37,8.9 6.26,9.01 6.26,11.76 6.06,11.95 D4.3 6.06,13.14 6.19,13.27 7.77,13.27 8.96,14.46 9.71,14.46 10.56,15.31 U4.1 | v7.71,6.51 7.71,6.71 7.36,7.06 J5.B6
  Bottom 0.2: v7.71,6.51 6.51,6.51 v6.41,6.61
D-
  Top 0.2: U4.2 10.06,15.31 9.56,14.81 8.81,14.81 7.62,13.62 4.36,13.62 3.95,13.21 D4.2 4.97,12.65 5.11,12.51 5.11,11.91 5.87,11.15 J5.B7 5.87,6.93 5.8,6.86 5.8,6.36 6.16,6 6.66,6 7.02,6.36 7.02,6.86 6.86,7.02 J5.A7
DIO_7
  Top 0.2: J1.16 1.31,48.91 2.61,48.91 2.91,48.61 2.91,44.51 3.15,44.27 U$1.2 6.72,44.27 6.96,44.51 6.96,45.96 7.86,46.86 16.66,46.86 18.71,48.91 21.71,48.91 22.41,49.61 22.41,51.49 D2.A
DIO_8  (via drill 0.3)
  Top 0.2: J1.15 2.25,46.27 2.56,45.96 2.56,43.36 2.92,43 U$1.3 v5.3,43 v5.31,43.01 6.11,43.01 7.31,44.21 7.31,45.81 8.01,46.51 v17.61,46.51 17.71,46.51 | v3.41,49.91 3.41,50.41 3.09,50.73 D1.A
  Bottom 0.2: v5.31,43.01 3.51,43.01 2.81,43.71 2.81,49.31 v3.41,49.91 | U6.2 14.58,46.08 14.96,46.46 U$2.2 15.82,46.51 v17.61,46.51
DIO_9  (via drill 0.3)
  Top 0.2: J1.14 1.39,43.73 2.31,42.81 2.31,42.21 2.79,41.73 U$1.4 6.73,41.73 7.41,42.41 v7.41,43.21
  Bottom 0.2: U6.5 11.17,44.37 10.72,43.92 U$2.5 8.12,43.92 v7.41,43.21
DIO_10  (via drill 0.3)
  Top 0.2: J1.13 2.13,41.19 2.86,40.46 U$1.5 5.26,40.46 v5.31,40.41
  Bottom 0.2: U6.6 10.28,45.58 9.89,45.19 U$2.6 9.01,45.21 7.41,45.21 6.61,44.41 6.61,41.11 5.91,40.41 v5.31,40.41
DIO_11
  Top 0.2: U$1.6 2.99,39.19 2.45,38.65 J1.12
DIO_12  (via drill 0.3)
  Top 0.2: J1.11 1.21,36.81 2.32,37.92 U$1.7 5.5,37.92 v5.81,37.61 | v10.72,14.54 9.56,13.38 U4.8
  Bottom 0.2: v5.81,37.61 5.81,36.77 6.32,36.26 6.32,35.76 6.16,35.6 6.16,27.06 6.46,26.76 10.66,26.76 11.56,25.86 11.56,21.2 10.31,19.95 9.26,19.95 8.57,19.26 8.57,14.94 8.97,14.54 v10.72,14.54
DIO_13  (via drill 0.3)
  Top 0.2: J1.10 1.31,33.67 1.31,34.52 2.4,35.62 2.4,36.11 2.94,36.65 U$1.8 5.37,36.65 5.71,36.31 v5.71,36.01 | U4.9 10.06,13.22 10.5,13.66 v10.75,13.66
  Bottom 0.2: v5.71,36.01 5.71,27.01 6.31,26.41 10.51,26.41 11.21,25.71 11.21,21.39 10.14,20.32 9.09,20.32 8.2,19.43 8.2,14.81 8.84,14.17 10.24,14.17 10.47,13.93 10.48,13.93 v10.75,13.66
DIO_14  (via drill 0.3)
  Top 0.2: U$1.9 2.88,35.38 2.4,34.9 2.4,33.08 1.21,31.88 J1.9 | BTN2.4 v15.61,23.61 BTN2.3 | U$1.9 4.2,35.18 | U$1.9 5.74,35.38 5.94,35.18 15.64,35.18 v15.71,35.11
  Bottom 0.2: v15.61,23.61 14.71,23.61 13.76,24.56 13.76,31.56 14.31,32.11 15.11,32.11 15.41,32.41 15.41,34.81 v15.71,35.11
DIO_15  (via drill 0.3)
  Top 0.2: BTN1.3 v19.41,23.71 BTN1.4 | U$3.3 2.76,16.26 2.4,16.62 2.4,26.44 1.21,27.64 J1.8 1.21,29.34 2.75,30.89 2.75,33.71 3.15,34.11 U$1.10 5.21,34.11 5.93,34.83 14.99,34.83 15.71,34.11 v17.71,34.11
  Bottom 0.2: v19.41,23.71 17.77,25.35 17.77,34.05 v17.71,34.11
DIO_18
  Top 0.2: J2.3 24.11,16.64 22.92,17.84 22.92,19.54 22.56,19.89 22.56,22.27 22.21,22.62 22.21,24.67 21.86,25.02 21.86,26.26 21.51,26.6 14.02,26.6 13.11,27.51 12.21,27.51 12.02,27.7 U$1.17
DIO_19
  Top 0.2: J2.4 24.11,19.18 22.92,20.38 22.92,22.42 22.56,22.77 22.56,24.81 22.21,25.16 22.21,26.41 21.66,26.96 14.16,26.96 13.29,27.83 U$1.18
DIO_20  (via drill 0.3)
  Top 0.2: J2.5 24.11,21.72 22.92,22.92 22.92,24.96 22.56,25.31 22.56,26.55 21.81,27.31 17.51,27.31 17.1,27.72 U$1.21 17.1,31.02 v16.71,31.41
  Bottom 0.2: U6.1 13.64,47.34 14.03,47.73 U$2.1 | v16.71,31.41 16.37,31.75 16.37,33.52 17.02,34.17 17.02,38.02 18.41,39.41 18.41,47.11 17.78,47.73 U$2.1 | R6.2 15.78,49.09 U$2.1
DIO_21
  Top 0.2: J2.6 24.11,24.26 22.92,25.46 22.92,26.7 21.95,27.66 18.51,27.66 18.35,27.82 U$1.22
DIO_22
  Top 0.2: U$1.25 22.28,34.1 22.56,33.81 22.56,32.93 22.92,32.58 22.92,30.5 24.11,29.31 J2.8
DIO_23
  Top 0.2: U$1.26 22.55,35.37 22.92,35 22.92,33.08 24.11,31.88 J2.9
DIO_24
  Top 0.2: U$1.27 22.59,36.64 22.92,36.31 22.92,35.62 24.01,34.52 24.01,33.67 J2.10
DIO_25
  Top 0.2: U$1.28 23.11,37.91 24.11,36.91 J2.11
DIO_26
  Top 0.2: U$1.29 22.34,39.18 22.91,38.61 24.07,38.61 J2.12
DIO_27
  Top 0.2: U$1.30 22.25,40.45 22.99,41.19 J2.13
DIO_28
  Top 0.2: U$1.31 22.42,41.72 22.91,42.21 22.91,42.91 23.73,43.73 J2.14
DIO_29
  Top 0.2: U$1.32 22.29,42.99 22.76,43.46 22.76,45.96 23.07,46.27 J2.15
DIO_30
  Top 0.2: U$1.33 22.16,44.26 22.41,44.51 22.41,48.51 22.71,48.81 J2.16
DTR
  Top 0.2: U$3.4 5.26,16.26 4.61,16.91 U$3.2
EN
  Top 0.2: U2.3 18.36,16.46 U3.1 | U3.1 19.84,16.46 20.43,17.05 20.43,17.45 20.87,17.89 R2.1 | R14.1 18.38,15.43 18.58,15.63 U3.1
GND  (via drill 0.3)
  Top 0.2: U$1.12 U$1.11 | R4.1 4.91,11.31 4.61,11.61 v3.71,11.61 | U$1.19 14.56,29.86 v14.61,29.91 | BTN2.1 17.96,21.66 18.41,22.11 v18.41,23.71 | C1.2 20.85,20.36 v21.16,20.05 | J5.S5 2.31,7.75 2.44,7.88 J5.A1B12 | J5.S6 10.94,7.71 10.77,7.88 J5.B1A12
  Top 0.508: U1.2 22.41,11.31 v22.51,11.21 23.01,10.71 J2.1
  other vias: 5.21,5.61 4.51,18.91 6.21,20.31 6.41,50.71 7.91,50.71 9.51,50.71 11.11,50.71 12.81,50.71 14.71,50.71 16.51,50.71 18.51,50.71 18.61,32.01 18.61,30.21 4.51,2.81 8.71,2.81 0.71,5.21 0.71,3.71 0.71,2.21 24.51,8.61 24.51,5.51 24.51,3.91 24.51,2.38 24.51,7.21 4.61,50.71 18.31,13.41 5.21,26.41 1.51,1.01 2.91,0.71 4.21,0.71 5.61,0.71 7.01,0.71 8.41,0.71 10.01,0.71 11.61,0.71 17.61,0.71 19.41,0.71 21.21,0.71 21.01,30.21 20.91,50.71 0.71,6.61 11.99,30.05 3.88,28.78 19.87,15.72 22.47,16.88 17.41,16.59 15.7,15.54 14.82,9.84 7.24,9.54 6.81,18.82 7.49,14.46 0.71,8.01 15.89,19.26 13.71,14.81 9.59,17.36 20.65,8.25 20.65,9.13 20.65,7.39 13.64,43.96 13.74,48.33 16.21,2.08 23.06,2 10.61,37.21 14.41,37.21 17.51,43.01 10.61,34.01 14.41,34.01 12.61,37.21 12.61,34.01 19.61,42.41 19.61,45.01 19.61,47.61
  pour Bottom: -0.4,51.31 -0.4,-0.29 25.51,-0.29 25.51,51.31
  pour Top: -0.59,51.41 25.71,51.41 25.71,-0.39 -0.59,-0.39
N$2
  Top 0.2: R3.2 1.48,50.84 1.33,50.99 D1.C
N$3
  Top 0.2: R5.2 23.84,50.64 24.19,50.99 D2.C
N$4
  Bottom 0.2: U5.5 13.62,13.42 13.51,13.31 13.51,12.91 13.41,12.81 R18.2 | U5.2 U5.3
  Bottom 0.254: U5.5 U5.2
N$7
  Top 0.2: D3.A 12.61,5.29 12.61,5.91 12.51,6.01 R9.2
N$8
  Top 0.305: U1.5 19.86,10.36 20.4,10.9 20.4,13.37 R11.2
N$9
  Top 0.2: D6.A R12.1
N$10
  Bottom 0.2: R17.2 13,14.01 13.51,14.01 13.61,14.11 14.32,14.11 U5.6 14.35,16.39 13.86,16.88 12.64,16.88 11.71,17.82 Q2.1
N$11  (via drill 0.3)
  Top 0.2: D6.C 14.11,4.01 14.51,4.41 v15.41,4.41 | U1.1 22.26,10.36 22.81,9.81 v22.81,8.51
  Bottom 0.2: v15.41,4.41 16.01,4.41 16.61,3.81 22.31,3.81 22.81,4.31 v22.81,8.51
N$12
  Bottom 0.2: U6.7 11.14,46.11 10.21,46.11 9.81,46.51 9.07,46.51 U$2.7 7.35,46.46 7.01,46.81 7.01,48.71 7.46,49.16 R15.2
N$15
  Bottom 0.2: U$2.3 14.92,45.19 14.54,45.58 U6.3 13.24,45.58 12.91,45.91 12.91,47.21 11.84,48.28 R16.1
RESET  (via drill 0.3)
  Top 0.2: J2.7 24.11,26.8 22.56,28.35 22.56,32.41 22.15,32.83 U$1.24 14.43,32.83 v14.41,32.81 | RST.4 v13.41,23.71 RST.3 13.41,20.91 13.11,20.61 8.51,20.61 7.81,19.91 7.81,18.11 7.26,17.56 U$3.6
  Bottom 0.2: v14.41,32.81 13.41,31.81 v13.41,23.71
RTS
  Top 0.2: U$3.1 4.66,17.56 5.31,16.91 U$3.5 7.29,16.91 7.87,16.33 7.87,15.41 8.05,15.23 8.86,15.23 9.06,15.43 U4.4
TCK  (via drill 0.3)
  Top 0.2: U$1.14 8.21,29.51 8.01,29.71 6.31,29.71 6.01,29.41 6.01,27.81 6.59,27.23 6.59,25.43 7.32,24.7 7.32,24.2 7.74,23.78 J3.4 10.48,23.78 v10.51,23.81
  Bottom 0.2: J1.5 2.4,22.06 2.4,23.31 2.9,23.81 v10.51,23.81
TDI  (via drill 0.3)
  Top 0.2: U$1.16 10.75,29.87 10.41,30.21 9.51,30.21 9.3,30.41 5.92,30.41 5.3,29.8 5.3,27.52 5.88,26.94 5.88,25.14 6.62,24.41 6.62,22.9 8.28,21.24 J3.8 10.15,21.24 v10.53,21.62
  Bottom 0.2: J1.3 1.21,16.64 2.75,18.19 2.75,21.42 3.11,21.77 3.11,22.81 3.4,23.1 9.41,23.1 9.71,22.81 9.71,22.06 10.15,21.62 v10.53,21.62
TDO  (via drill 0.3)
  Top 0.2: U$1.15 9.56,28.77 9.56,29.66 9.16,30.06 6.06,30.06 5.66,29.66 5.66,27.66 6.24,27.09 6.24,25.29 6.97,24.55 6.97,23.05 7.51,22.51 J3.6 v10.51,22.51
  Bottom 0.2: J1.4 2.4,19.52 2.4,21.56 2.75,21.92 2.75,23.1 3.11,23.46 9.71,23.46 10.51,22.66 v10.51,22.51
TMS  (via drill 0.3)
  Top 0.2: U$1.13 6.94,25.58 7.47,25.05 J3.2 10.47,25.05 v10.51,25.01
  Bottom 0.2: J1.6 1.51,23.71 2.3,23.71 2.76,24.16 9.66,24.16 v10.51,25.01
UVCC
  Top 0.2: U2.1 16.48,17.69
  Top 0.32: U2.1 16.46,18.85 16.81,19.2 18.62,19.2 19.16,18.66 C1.1
  Top 0.406: U2.1 | U2.1 14.71,17.71 14.21,17.21 14.21,15.71 14.61,15.31 14.9,15.31 15.21,15 D5.C
  Top 0.61: D5.C 15.26,14.21 Q1.2
V+  (via drill 0.3)
  Top 0.2: U4.10 10.56,11.22 10.37,11.03 9.23,11.03 9.06,11.2 U4.7 9.06,12.82 v8.75,13.13 | R9.1 v12.51,8.31
  Top 0.305: U4.10 10.56,12.36 11.41,13.21 11.41,19.41 11.9,19.9 13.48,19.9 13.93,20.36 C2.1
  Top 0.406: C2.1 16.41,20.36 U2.5
  Bottom 0.2: v12.51,8.31 12.25,8.57 12.25,9.27 11.61,9.91 9.91,9.91 8.75,11.07 v8.75,13.13
  Bottom 0.305: v8.75,13.13 9.49,13.13 10.61,12.01 11.41,12.01 | 12.62,15.81 Q2.3 11.45,15.77 11.41,15.81 | U5.4 14.35,12.25 14.11,12.01 11.41,12.01 | 11.41,15.81 10.45,16.77 10.45,19.01 11.31,19.87 SJ1.1 | 11.41,12.01 11.41,15.81
VCC  (via drill 0.3)
  Top 0.076: 21.33,15.56 21.33,15.45
  Top 0.2: 20.87,15.42 U3.3 | R2.2 | 21.27,15.51 21.33,15.45 | 22.7,12.08 21.09,12.08 21.09,15.65 22.27,15.65 23.01,14.9 | 22.7,12.08 24.08,12.08 24.42,12.42 24.42,13.49 23.01,14.9 | v22.66,14.62 22.94,14.9 23.01,14.9 | 22.68,12.09 22.7,12.08 | v18.64,8.29 v18.64,9.14
  Top 0.406: 21.27,15.51 U3.3 21.31,15.51 | R2.2 21.32,15.57 21.33,15.56 | 18.63,7.78 CN2.1 18.62,7.25 18.62,7.85 | v18.64,8.29 18.64,7.78 18.63,7.78 | 17.01,7.81 17.04,7.78 18.63,7.78
  Top 0.61: Q1.3 16.21,8.61 v16.31,8.51 17.01,7.81 18.51,7.81
  Bottom 0.2: 21.09,12.26 21.09,15.65 22.27,15.65 24.41,13.51 24.41,12.36 24.09,12.05 21.01,12.05 | v18.65,7.4 18.66,7.42 PAD2.1 18.66,8.27 v18.64,8.29
  Bottom 0.305: v22.67,13.83 v22.67,14.61 | v22.66,14.62 v22.67,14.61 | v22.67,14.61 v21.92,14.61 21.95,14.58 v21.95,13.86 21.97,13.84 21.97,13.83 | v22.67,14.61 22.7,14.58 | 21.97,13.83 v22.67,13.83 | 21.97,13.83 v21.97,13.07 v21.98,13.06 v22.68,13.06 v22.67,13.07 v22.67,13.83 | 22.63,13.03 21.85,13.03 21.84,13.04 21.84,14.69 22.59,14.69 v22.66,14.62 | 22.63,14.59 v22.66,14.62
  Bottom 0.61: 21.09,12.26 18.25,12.26 16.31,10.32 v16.31,8.51
  pour Bottom: 21.84,14.69 21.84,13.03 22.71,13.03 22.74,13.06 22.74,14.62 22.67,14.69
  pour Top (no thermals): 21.11,15.65 21.11,12.08 24.08,12.08 24.31,12.31 24.31,13.51 22.16,15.65
  pour Bottom (no thermals): 21.01,15.65 21.01,12.05 24.1,12.05 24.41,12.36 24.41,13.51 22.26,15.65

### Text on the board
tNames: R | G | 7 | 30 | 8 | 29 | 9 | 28 | 10 | 27 | 11 | 26 | 12 | 25 | 13 | 24 | JLCJLCJLCJLC | 14 | 23 | 15 | 22 | . | JTAG | GND | RST | 21 | TMS | TCK | 20 | 19 | TDO | TDI | 18 | 3V3 | BAT | 5V | GND | PWR | CHG
bNames: DIO7 | DIO30 | DIO8 | DIO29 | DIO9 | DIO28 | DIO10 | DIO27 | DIO11 | DIO26 | DIO12/RX | DIO25 | DIO13/TX | DIO24 | DIO14 | DIO23 | DIO15 | DIO22 | GND | RESET | TMS | DIO21 | TCK | DIO20 | TDO/DIO16 | DIO19 | DIO19 | TDI/DIO17 | DIO18 | 3V3 | BAT | +5V | GND | + | - | t.me/deaxx